# EAGLE board FastDataAcqSch (EAGLE 6.5.0), part 1 of 3
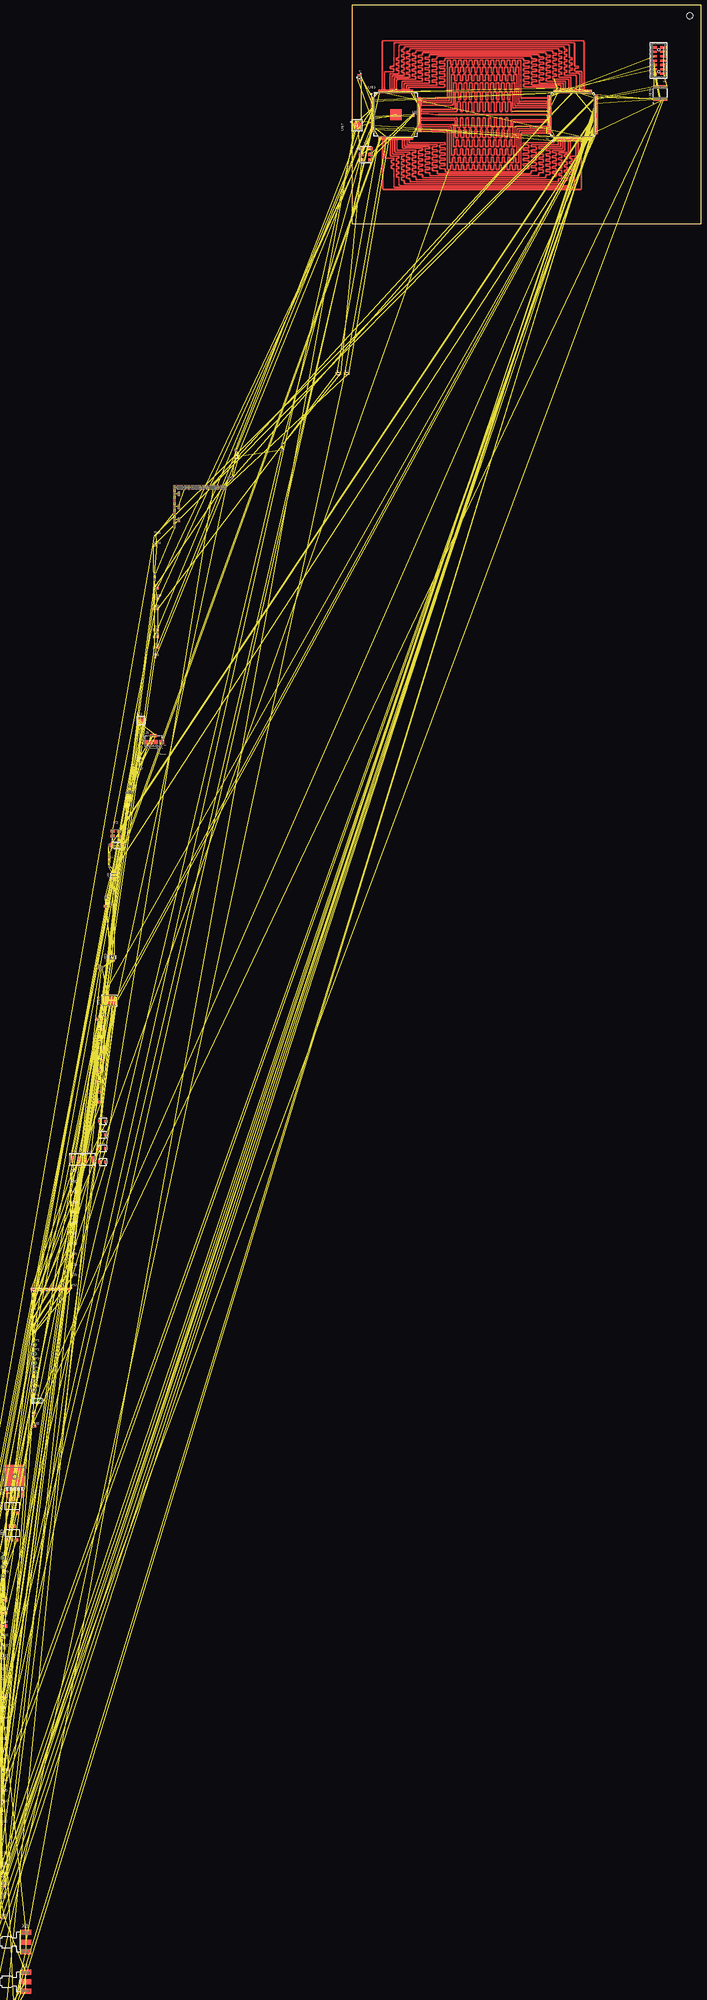
[diagram p3: board, top side]
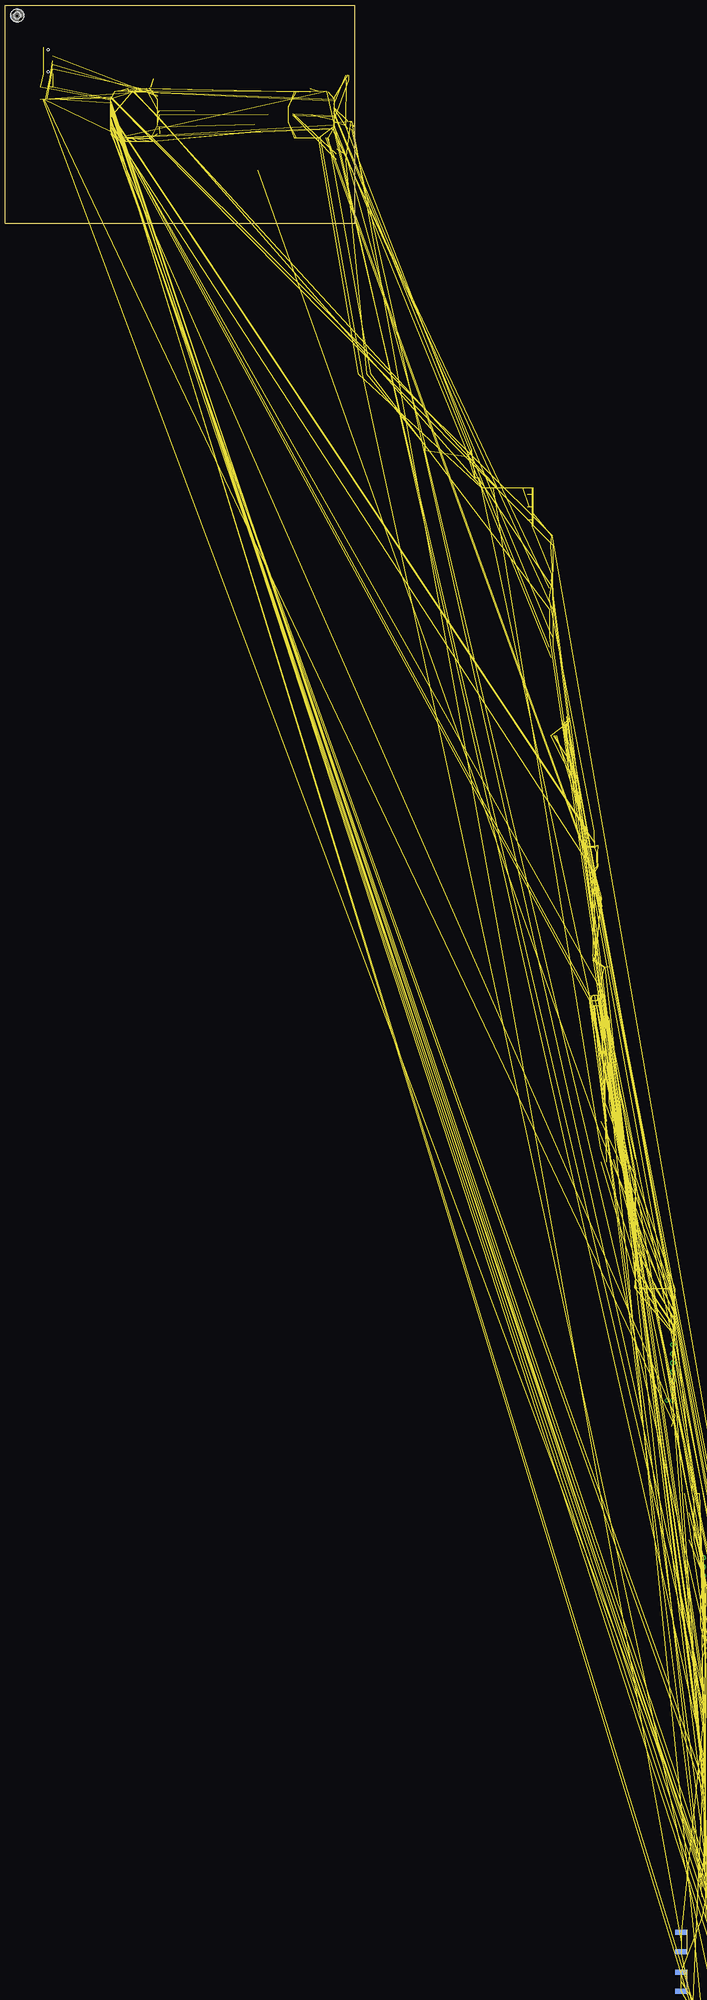
[diagram p4: board, bottom side, seen from below]

Size 160 x 100 mm. Coordinates in mm from the lower left corner, seen from the top.
Outline: 0,0 160,0 160,100 0,100 0,0
Copper layers ((1+2)*(3+16)): Top 0.035mm / dielectric 5mil / GND 0.035mm / dielectric 0.15mm / Power 0.035mm / dielectric 5mil / Bottom 0.035mm
Design rules "default *": minimum track width 10mil, minimum drill 24mil, track to track 8mil, track to pad 8mil, pad to pad 8mil, via to via 8mil, smd to smd 8mil, copper to edge 40mil, drill to drill 8mil, minimum pad ring 10mil, minimum via ring 8mil, stop-mask expansion 4mil, vias tented up to drill 0mil, thermal gap 10mil

## Footprints (pad centres in the part's own frame; a part is rotated, then mirrored left to right if it is on the bottom)
C0603 = smd 1.1 x 1: 1 -0.85,0; 2 0.85,0
2917_MURATA_CAP = smd 2.4 x 2.8: P$1 3.2,0; P$2 -3.2,0
C0201 = smd 0.25 x 0.35: 1 -0.25,0; 2 0.25,0
0805 = smd 0.8 x 1.2: 1 -0.9,0; 2 0.9,0
C0805 = smd 1.3 x 1.5: 1 -0.95,0; 2 0.95,0
0306REVERSE = smd 0.35 x 1.6: P$1 -0.325,0; P$2 0.325,0
0204REVERSE = smd 0.2 x 1: P$1 -0.2,0; P$2 0.2,0
0603_LED = smd 0.8 x 0.8: ANODE 0.75,0; CATHODE -0.75,0
2,8 = hole 2.8: 0,0
Q5-DD = smd 1 x 3.4: 1 -3.4,-7.875; 2 -1.7,-7.875; 3 0,-7.875; 4 1.7,-7.875; 5 3.4,-7.875 | smd 8.5 x 9.6: 6 0,0.325
QFN16 = smd 0.7 x 0.35: 1 -1.725,0.975; 2 -1.725,0.325; 3 -1.725,-0.325; 4 -1.725,-0.975; 9 1.725,-0.975; 10 1.725,-0.325; 11 1.725,0.325; 12 1.725,0.975 | smd 0.35 x 0.7: 5 -0.975,-1.725; 6 -0.325,-1.725; 7 0.325,-1.725; 8 0.975,-1.725; 13 0.975,1.725; 14 0.325,1.725; 15 -0.325,1.725; 16 -0.975,1.725 | smd 1 x 1: TAB 0,0
SOP65P490X110-8N = smd 1.499 x 0.432: 1 -2.057,0.965; 2 -2.057,0.33; 3 -2.057,-0.33; 4 -2.057,-0.965; 5 2.057,-0.965; 6 2.057,-0.33; 7 2.057,0.33; 8 2.057,0.965
USB_MICROAB_SMT_1 = smd 0.4 x 1.4: D+ 0,4.3; D- -0.65,4.3; GND 1.3,4.3; ID 0.65,4.3; VCC -1.3,4.3 | smd 2.3 x 1.9: P$1 3.75,1.45; P$5 -3.75,1.45 | smd 1.8 x 1.9: P$2 1.15,1.45; P$4 -1.15,1.45
MICRO-FIT_3.02POS_RA_SMD = smd 1.27 x 2.92: P$1 1.5,4.305; P$2 -1.5,4.305 | smd 3.43 x 1.65: P$3 5.385,-1.165; P$4 -5.385,-1.165
1X02 = drill 1.016 pad 1.88: 1 0,0; 2 2.54,0
1X10 = drill 1.016 pad 1.88: 1 0,0; 2 2.54,0; 3 5.08,0; 4 7.62,0; 5 10.16,0; 6 12.7,0; 7 15.24,0; 8 17.78,0; 9 20.32,0; 10 22.86,0
3.0X3.6_VISHAY = smd 1.5 x 1.2: P$1 -1.35,0; P$2 1.35,0
5.18X5.49_VISHAY = smd 1.915 x 2.79: P$1 -2.038,0; P$2 2.038,0
MURATA_BLM18 = smd 0.65 x 0.7: P$1 0.675,0; P$2 -0.675,0
ACM7060_CHOKE = smd 2.5 x 1.5: P$1 -3.25,1.5; P$2 -3.25,-1.5; P$3 3.25,-1.5; P$4 3.25,1.5
R0603 = smd 1 x 1.1: 1 -0.85,0; 2 0.85,0
R0201 = smd 0.28 x 0.43: 1 -0.255,0; 2 0.255,0
R0402 = smd 0.7 x 0.9: 1 -0.65,0; 2 0.65,0
P1-13 = drill 1.321 pad 2.159 octagon: TP 0,0
128HLQFP = smd 0.3 x 1.6: P$1 -7.75,-10.6; P$2 -7.25,-10.6; P$3 -6.75,-10.6; P$4 -6.25,-10.6; P$5 -5.75,-10.6; P$6 -5.25,-10.6; P$7 -4.75,-10.6; P$8 -4.25,-10.6; P$9 -3.75,-10.6; P$10 -3.25,-10.6; P$11 -2.75,-10.6; P$12 -2.25,-10.6; P$13 -1.75,-10.6; P$14 -1.25,-10.6; P$15 -0.75,-10.6; P$16 -0.25,-10.6; P$17 0.25,-10.6; P$18 0.75,-10.6; P$19 1.25,-10.6; P$20 1.75,-10.6; P$21 2.25,-10.6; P$22 2.75,-10.6; P$23 3.25,-10.6; P$24 3.75,-10.6; P$25 4.25,-10.6; P$26 4.75,-10.6; P$27 5.25,-10.6; P$28 5.75,-10.6; P$29 6.25,-10.6; P$30 6.75,-10.6; P$31 7.25,-10.6; P$32 7.75,-10.6; P$65 7.75,10.6; P$66 7.25,10.6; P$67 6.75,10.6; P$68 6.25,10.6; P$69 5.75,10.6; P$70 5.25,10.6; P$71 4.75,10.6; P$72 4.25,10.6; P$73 3.75,10.6; P$74 3.25,10.6; P$75 2.75,10.6; P$76 2.25,10.6; P$77 1.75,10.6; P$78 1.25,10.6; P$79 0.75,10.6; P$80 0.25,10.6; P$81 -0.25,10.6; P$82 -0.75,10.6; P$83 -1.25,10.6; P$84 -1.75,10.6; P$85 -2.25,10.6; P$86 -2.75,10.6; P$87 -3.25,10.6; P$88 -3.75,10.6; P$89 -4.25,10.6; P$90 -4.75,10.6; P$91 -5.25,10.6; P$92 -5.75,10.6; P$93 -6.25,10.6; P$94 -6.75,10.6; P$95 -7.25,10.6; P$96 -7.75,10.6 | smd 1.6 x 0.3: P$33 10.6,-7.75; P$34 10.6,-7.25; P$35 10.6,-6.75; P$36 10.6,-6.25; P$37 10.6,-5.75; P$38 10.6,-5.25; P$39 10.6,-4.75; P$40 10.6,-4.25; P$41 10.6,-3.75; P$42 10.6,-3.25; P$43 10.6,-2.75; P$44 10.6,-2.25; P$45 10.6,-1.75; P$46 10.6,-1.25; P$47 10.6,-0.75; P$48 10.6,-0.25; P$49 10.6,0.25; P$50 10.6,0.75; P$51 10.6,1.25; P$52 10.6,1.75; P$53 10.6,2.25; P$54 10.6,2.75; P$55 10.6,3.25; P$56 10.6,3.75; P$57 10.6,4.25; P$58 10.6,4.75; P$59 10.6,5.25; P$60 10.6,5.75; P$61 10.6,6.25; P$62 10.6,6.75; P$63 10.6,7.25; P$64 10.6,7.75; P$97 -10.6,7.75; P$98 -10.6,7.25; P$99 -10.6,6.75; P$100 -10.6,6.25; P$101 -10.6,5.75; P$102 -10.6,5.25; P$103 -10.6,4.75; P$104 -10.6,4.25; P$105 -10.6,3.75; P$106 -10.6,3.25; P$107 -10.6,2.75; P$108 -10.6,2.25; P$109 -10.6,1.75; P$110 -10.6,1.25; P$111 -10.6,0.75; P$112 -10.6,0.25; P$113 -10.6,-0.25; P$114 -10.6,-0.75; P$115 -10.6,-1.25; P$116 -10.6,-1.75; P$117 -10.6,-2.25; P$118 -10.6,-2.75; P$119 -10.6,-3.25; P$120 -10.6,-3.75; P$121 -10.6,-4.25; P$122 -10.6,-4.75; P$123 -10.6,-5.25; P$124 -10.6,-5.75; P$125 -10.6,-6.25; P$126 -10.6,-6.75; P$127 -10.6,-7.25; P$128 -10.6,-7.75 | smd 5 x 5: P$129 0,0
TQG144 = smd 0.3 x 1.6: P$1 -8.75,-10.7; P$2 -8.25,-10.7; P$3 -7.75,-10.7; P$4 -7.25,-10.7; P$5 -6.75,-10.7; P$6 -6.25,-10.7; P$7 -5.75,-10.7; P$8 -5.25,-10.7; P$9 -4.75,-10.7; P$10 -4.25,-10.7; P$11 -3.75,-10.7; P$12 -3.25,-10.7; P$13 -2.75,-10.7; P$14 -2.25,-10.7; P$15 -1.75,-10.7; P$16 -1.25,-10.7; P$17 -0.75,-10.7; P$18 -0.25,-10.7; P$19 0.25,-10.7; P$20 0.75,-10.7; P$21 1.25,-10.7; P$22 1.75,-10.7; P$23 2.25,-10.7; P$24 2.75,-10.7; P$25 3.25,-10.7; P$26 3.75,-10.7; P$27 4.25,-10.7; P$28 4.75,-10.7; P$29 5.25,-10.7; P$30 5.75,-10.7; P$31 6.25,-10.7; P$32 6.75,-10.7; P$33 7.25,-10.7; P$34 7.75,-10.7; P$35 8.25,-10.7; P$36 8.75,-10.7; P$73 8.75,10.7; P$74 8.25,10.7; P$75 7.75,10.7; P$76 7.25,10.7; P$77 6.75,10.7; P$78 6.25,10.7; P$79 5.75,10.7; P$80 5.25,10.7; P$81 4.75,10.7; P$82 4.25,10.7; P$83 3.75,10.7; P$84 3.25,10.7; P$85 2.75,10.7; P$86 2.25,10.7; P$87 1.75,10.7; P$88 1.25,10.7; P$89 0.75,10.7; P$90 0.25,10.7; P$91 -0.25,10.7; P$92 -0.75,10.7; P$93 -1.25,10.7; P$94 -1.75,10.7; P$95 -2.25,10.7; P$96 -2.75,10.7; P$97 -3.25,10.7; P$98 -3.75,10.7; P$99 -4.25,10.7; P$100 -4.75,10.7; P$101 -5.25,10.7; P$102 -5.75,10.7; P$103 -6.25,10.7; P$104 -6.75,10.7; P$105 -7.25,10.7; P$106 -7.75,10.7; P$107 -8.25,10.7; P$108 -8.75,10.7 | smd 1.6 x 0.3: P$37 10.7,-8.75; P$38 10.7,-8.25; P$39 10.7,-7.75; P$40 10.7,-7.25; P$41 10.7,-6.75; P$42 10.7,-6.25; P$43 10.7,-5.75; P$44 10.7,-5.25; P$45 10.7,-4.75; P$46 10.7,-4.25; P$47 10.7,-3.75; P$48 10.7,-3.25; P$49 10.7,-2.75; P$50 10.7,-2.25; P$51 10.7,-1.75; P$52 10.7,-1.25; P$53 10.7,-0.75; P$54 10.7,-0.25; P$55 10.7,0.25; P$56 10.7,0.75; P$57 10.7,1.25; P$58 10.7,1.75; P$59 10.7,2.25; P$60 10.7,2.75; P$61 10.7,3.25; P$62 10.7,3.75; P$63 10.7,4.25; P$64 10.7,4.75; P$65 10.7,5.25; P$66 10.7,5.75; P$67 10.7,6.25; P$68 10.7,6.75; P$69 10.7,7.25; P$70 10.7,7.75; P$71 10.7,8.25; P$72 10.7,8.75; P$109 -10.7,8.75; P$110 -10.7,8.25; P$111 -10.7,7.75; P$112 -10.7,7.25; P$113 -10.7,6.75; P$114 -10.7,6.25; P$115 -10.7,5.75; P$116 -10.7,5.25; P$117 -10.7,4.75; P$118 -10.7,4.25; P$119 -10.7,3.75; P$120 -10.7,3.25; P$121 -10.7,2.75; P$122 -10.7,2.25; P$123 -10.7,1.75; P$124 -10.7,1.25; P$125 -10.7,0.75; P$126 -10.7,0.25; P$127 -10.7,-0.25; P$128 -10.7,-0.75; P$129 -10.7,-1.25; P$130 -10.7,-1.75; P$131 -10.7,-2.25; P$132 -10.7,-2.75; P$133 -10.7,-3.25; P$134 -10.7,-3.75; P$135 -10.7,-4.25; P$136 -10.7,-4.75; P$137 -10.7,-5.25; P$138 -10.7,-5.75; P$139 -10.7,-6.25; P$140 -10.7,-6.75; P$141 -10.7,-7.25; P$142 -10.7,-7.75; P$143 -10.7,-8.25; P$144 -10.7,-8.75
38-QFN_(5X7) = smd 0.25 x 0.7: P$1 -2.75,-2.4; P$2 -2.25,-2.4; P$3 -1.75,-2.4; P$4 -1.25,-2.4; P$5 -0.75,-2.4; P$6 -0.25,-2.4; P$7 0.25,-2.4; P$8 0.75,-2.4; P$9 1.25,-2.4; P$10 1.75,-2.4; P$11 2.25,-2.4; P$12 2.75,-2.4; P$20 2.75,2.4; P$21 2.25,2.4; P$22 1.75,2.4; P$23 1.25,2.4; P$24 0.75,2.4; P$25 0.25,2.4; P$26 -0.25,2.4; P$27 -0.75,2.4; P$28 -1.25,2.4; P$29 -1.75,2.4; P$30 -2.25,2.4; P$31 -2.75,2.4 | smd 0.7 x 0.25: P$13 3.4,-1.5; P$14 3.4,-1; P$15 3.4,-0.5; P$16 3.4,0; P$17 3.4,0.5; P$18 3.4,1; P$19 3.4,1.5; P$32 -3.4,1.5; P$33 -3.4,1; P$34 -3.4,0.5; P$35 -3.4,0; P$36 -3.4,-0.5; P$37 -3.4,-1; P$38 -3.4,-1.5 | smd 5.15 x 3.15: P$39 0,0
SOT223 = smd 0.991 x 1.499: 1 -2.299,-3.15; 2 0,-3.15; 3 2.299,-3.15 | smd 3.277 x 1.499: 4 0,3.15
SOT23-8 = smd 0.45 x 1.1: P$1 -0.975,-1.3; P$2 -0.325,-1.3; P$3 0.325,-1.3; P$4 0.975,-1.3; P$5 0.975,1.3; P$6 0.325,1.3; P$7 -0.325,1.3; P$8 -0.975,1.3
16WQFN = smd 0.25 x 0.6: P$1 0.75,1.9; P$2 0.25,1.9; P$3 -0.25,1.9; P$4 -0.75,1.9; P$9 -0.75,-1.9; P$10 -0.25,-1.9; P$11 0.25,-1.9; P$12 0.75,-1.9 | smd 0.6 x 0.25: P$5 -1.9,0.75; P$6 -1.9,0.25; P$7 -1.9,-0.25; P$8 -1.9,-0.75; P$13 1.9,-0.75; P$14 1.9,-0.25; P$15 1.9,0.25; P$16 1.9,0.75 | smd 2.6 x 2.6: P$17 0,0
SC-70 = smd 0.4 x 0.9: P$1 -0.65,-1.1; P$2 0,-1.1; P$3 0.65,-1.1; P$4 0.65,1.1; P$5 -0.65,1.1
SOT23-6 = smd 0.6 x 1.1: P$1 -0.95,-1.35; P$2 0,-1.35; P$3 0.95,-1.35; P$4 0.95,1.35; P$5 0,1.35; P$6 -0.95,1.35
TSSOP20_XILINX = smd 1.5 x 0.45: P$1 -2.9,2.925; P$2 -2.9,2.275; P$3 -2.9,1.625; P$4 -2.9,0.975; P$5 -2.9,0.325; P$6 -2.9,-0.325; P$7 -2.9,-0.975; P$8 -2.9,-1.625; P$9 -2.9,-2.275; P$10 -2.9,-2.925; P$11 2.9,-2.925; P$12 2.9,-2.275; P$13 2.9,-1.625; P$14 2.9,-0.975; P$15 2.9,-0.325; P$16 2.9,0.325; P$17 2.9,0.975; P$18 2.9,1.625; P$19 2.9,2.275; P$20 2.9,2.925
C_AND_K_1101M2S3AQE2 = drill 1.854: P$1 4.699,4.763; P$2 0,4.763; P$3 -4.699,4.763; P$4 6.604,-4.763; P$5 -6.604,-4.763
J502-ND-142-0701-801/806 = smd 5.08 x 2.286: 1 2.565,0; G@1 2.565,4.42; G@2 2.565,-4.42 | smd 5.08 x 2.286 bottom: G@3 2.565,4.42; G@4 2.565,-4.42
87832-14 = smd 1 x 2.75: 1 -6,-2.15; 2 -6,2.15; 3 -4,-2.15; 4 -4,2.15; 5 -2,-2.15; 6 -2,2.15; 7 0,-2.15; 8 0,2.15; 9 2,-2.15; 10 2,2.15; 11 4,-2.15; 12 4,2.15; 13 6,-2.15; 14 6,2.15 | hole 1: -5,0; 5,0
SI530 = smd 1.95 x 1.55: P$1 -2.1,2.54; P$2 -2.1,0; P$3 -2.1,-2.54; P$4 2.1,-2.54; P$5 2.1,0; P$6 2.1,2.54
SI500S = smd 1.7 x 1.4: P$1 -1.45,-1.2; P$2 1.45,-1.2; P$3 1.45,1.2; P$4 -1.45,1.2
UMAX8 = smd 1.35 x 0.4: P$1 -2.15,0.975; P$2 -2.15,0.325; P$3 -2.15,-0.325; P$4 -2.15,-0.975; P$5 2.15,-0.975; P$6 2.15,-0.325; P$7 2.15,0.325; P$8 2.15,0.975

## Placement (x,y rotation side)
C1  10uF  [C0603]  -115.82,-373.84 0 top  (outside the outline)
C2  10uF  [C0603]  -115.82,-383.34 0 top  (outside the outline)
C3  100uF  [2917_MURATA_CAP]  -211.28,-896.24 0 top  (outside the outline)
C4  10uF  [C0603]  -115.82,-397.59 0 top  (outside the outline)
C5  NA  [C0603]  -160.15,-756.82 0 top  (outside the outline)
C6  10uF  [C0603]  -115.82,-388.09 0 top  (outside the outline)
C7  10uF  [C0603]  -115.82,-402.34 0 top  (outside the outline)
C8  10pF  [C0201]  -146.38,-508.61 0 top  (outside the outline)
C9  10pF  [C0201]  -146.38,-494.89 0 top  (outside the outline)
C10  33uF  [0805]  -131.27,-487.91 0 top  (outside the outline)
C11  33uF  [0805]  -143.05,-487.91 0 top  (outside the outline)
C12  10uF  [C0603]  -115.82,-378.59 0 top  (outside the outline)
C13  10uF  [C0603]  -115.82,-364.34 0 top  (outside the outline)
C14  10pF  [C0201]  -146.38,-501.75 0 top  (outside the outline)
C15  10uF  [C0603]  -115.82,-369.09 0 top  (outside the outline)
C17  10uF  [C0603]  -115.82,-392.84 0 top  (outside the outline)
C18  NA  [C0603]  -160.15,-775.82 0 top  (outside the outline)
C19  33uF  [0805]  -137.16,-487.91 0 top  (outside the outline)
C20  10uF  [C0603]  -160.15,-661.82 0 top  (outside the outline)
C21  10uF  [C0603]  -160.15,-666.57 0 top  (outside the outline)
C22  10uF  [C0603]  -160.15,-657.07 0 top  (outside the outline)
C23  22uF 150mOhm ESR  [C0805]  -159.64,-636.17 0 top  (outside the outline)
C24  22uF 150mOhm ESR  [C0805]  -159.64,-642.19 0 top  (outside the outline)
C25  10pF  [C0201]  -146.38,-505.18 0 top  (outside the outline)
C26  10pF  [C0201]  -146.38,-498.32 0 top  (outside the outline)
C27  10pF  [C0201]  -146.38,-491.46 0 top  (outside the outline)
C28  33uF  [0805]  -134.21,-487.91 0 top  (outside the outline)
C29  33uF  [0805]  -140.11,-487.91 0 top  (outside the outline)
C30  33uF  [0805]  -146,-487.91 0 top  (outside the outline)
C31  22uF 150mOhm ESR  [C0805]  -159.64,-630.15 0 top  (outside the outline)
C32  4.7uF  [0306REVERSE]  -59.97,-120.78 0 top  (outside the outline)
C33  4.7uF  [0306REVERSE]  -78.13,-120.78 0 top  (outside the outline)
C34  4.7uF  [0306REVERSE]  -81.43,-129.62 0 top  (outside the outline)
C35  4.7uF  [0306REVERSE]  -61.62,-120.78 0 top  (outside the outline)
C36  0.47uF  [0306REVERSE]  -79.78,-120.78 0 top  (outside the outline)
C37  0.47uF  [0306REVERSE]  -79.4,-129.62 0 top  (outside the outline)
C38  33uF  [0805]  -6.35,-68.58 0 top  (outside the outline)
C39  33uF  [0805]  -2.54,-68.58 0 top  (outside the outline)
C40  4.7uF  [0306REVERSE]  -63.27,-120.78 0 top  (outside the outline)
C41  0.47uF  [0306REVERSE]  -81.43,-120.78 0 top  (outside the outline)
C42  0.47uF  [0306REVERSE]  -81.43,-132.56 0 top  (outside the outline)
C43  .1uF  [0204REVERSE]  -179.63,-865.3 0 top  (outside the outline)
C44  .1uF  [0204REVERSE]  -177.6,-865.3 0 top  (outside the outline)
C45  0.47uF  [0306REVERSE]  -58.32,-120.78 0 top  (outside the outline)
C46  .1uF  [0204REVERSE]  -175.56,-865.3 0 top  (outside the outline)
C47  .1uF  [0204REVERSE]  -179.63,-867.89 0 top  (outside the outline)
C48  .1uF  [0204REVERSE]  -177.6,-867.89 0 top  (outside the outline)
C49  .1uF  [0204REVERSE]  -175.56,-867.89 0 top  (outside the outline)
C50  4.7uF  [0306REVERSE]  -81.43,-123.72 0 top  (outside the outline)
C51  4.7uF  [0306REVERSE]  -81.43,-135.51 0 top  (outside the outline)
C52  4.7uF  [0306REVERSE]  -64.92,-120.78 0 top  (outside the outline)
C53  .1uF  [0204REVERSE]  -179.63,-870.48 0 top  (outside the outline)
C54  .1uF  [0204REVERSE]  -177.6,-870.48 0 top  (outside the outline)
C55  0.47uF  [0306REVERSE]  -79.4,-123.72 0 top  (outside the outline)
C56  0.47uF  [0306REVERSE]  -79.4,-135.51 0 top  (outside the outline)
C57  4.7uF  [0306REVERSE]  -66.57,-120.78 0 top  (outside the outline)
C58  .1uF  [0204REVERSE]  -175.56,-870.48 0 top  (outside the outline)
C59  10nF  [C0201]  -221.26,-901.95 0 top  (outside the outline)
C60  4.7uF  [0306REVERSE]  -68.22,-120.78 0 top  (outside the outline)
C61  0.47uF  [0306REVERSE]  -81.43,-126.67 0 top  (outside the outline)
C62  0.47uF  [0306REVERSE]  -81.43,-138.46 0 top  (outside the outline)
C63  1uF  [0204REVERSE]  -223.06,-902.16 0 top  (outside the outline)
C64  10nF  [C0201]  -225.15,-905.38 0 top  (outside the outline)
C65  4.7uF  [0306REVERSE]  -69.88,-120.78 0 top  (outside the outline)
C68  4.7uF  [0306REVERSE]  -71.53,-120.78 0 top  (outside the outline)
C71  4.7uF  [0306REVERSE]  -73.18,-120.78 0 top  (outside the outline)
C74  4.7uF  [0306REVERSE]  -74.83,-120.78 0 top  (outside the outline)
C76  0.47uF  [0306REVERSE]  -76.48,-120.78 0 top  (outside the outline)
C77  100pF  [C0603]  -112.52,-312.6 0 top  (outside the outline)
C78  .1uF  [0204REVERSE]  -56.67,-116.36 0 top  (outside the outline)
C79  .1uF  [0204REVERSE]  -55.02,-116.36 0 top  (outside the outline)
C80  4.7nF  [C0201]  28.14,50.19 0 top
C81  4.7nF  [C0201]  28.14,49.4 0 top
C82  .1uF  [0204REVERSE]  -53.37,-103.68 0 top  (outside the outline)
C83  .1uF  [0204REVERSE]  -113.03,-308.69 0 top  (outside the outline)
C84  33uF  [0805]  -52.86,-106.63 0 top  (outside the outline)
C85  .1uF  [0204REVERSE]  -32.08,-101.09 0 top  (outside the outline)
C86  1uF  [0204REVERSE]  -32.08,-103.68 0 top  (outside the outline)
C87  33uF  [0805]  -160.12,-625.27 0 top  (outside the outline)
C88  4.7uF  [0306REVERSE]  -116.33,-340.36 0 top  (outside the outline)
C89  .1uF  [0204REVERSE]  -114.68,-340.69 0 top  (outside the outline)
C90  10nF  [C0201]  -160.5,-622.12 0 top  (outside the outline)
C91  .1uF  [0204REVERSE]  -111.38,-284.66 0 top  (outside the outline)
C92  10nF  [C0201]  -111.25,-287.91 0 top  (outside the outline)
C93  .1uF  [0204REVERSE]  -111.38,-294.13 0 top  (outside the outline)
C94  10nF  [C0201]  -111.25,-291.34 0 top  (outside the outline)
C95  10nF  [C0201]  -103.25,-270.81 0 top  (outside the outline)
C96  47pF  [C0201]  -103.25,-263.96 0 top  (outside the outline)
C97  .1uF  [0204REVERSE]  -90.45,-160.38 0 top  (outside the outline)
C98  47pF  [C0201]  -103.25,-267.39 0 top  (outside the outline)
C99  1uF  [0204REVERSE]  -90.45,-162.97 0 top  (outside the outline)
C100  .1uF  [0204REVERSE]  -103.38,-260.71 0 top  (outside the outline)
C101  .1uF  [0204REVERSE]  -101.73,-257.78 0 top  (outside the outline)
C102  4.7uF  [0306REVERSE]  -101.73,-260.38 0 top  (outside the outline)
C103  .1uF  [0204REVERSE]  -164.74,-862.71 0 top  (outside the outline)
C104  .1uF  [0204REVERSE]  -166.42,-862.71 0 top  (outside the outline)
C105  .1uF  [0204REVERSE]  -168.07,-862.71 0 top  (outside the outline)
C106  .1uF  [0204REVERSE]  -169.72,-862.71 0 top  (outside the outline)
C107  .1uF  [0204REVERSE]  -171.37,-862.71 0 top  (outside the outline)
C108  .1uF  [0204REVERSE]  -173.02,-862.71 0 top  (outside the outline)
C109  .1uF  [0204REVERSE]  -174.68,-862.71 0 top  (outside the outline)
C110  .1uF  [0204REVERSE]  -176.33,-862.71 0 top  (outside the outline)
C111  .1uF  [0204REVERSE]  -177.98,-862.71 0 top  (outside the outline)
C112  .1uF  [0204REVERSE]  -179.63,-862.71 0 top  (outside the outline)
D1  [0603_LED]  -229.77,-979.58 0 top  (outside the outline)
D2  [0603_LED]  -232.28,-984.33 0 top  (outside the outline)
D3  [0603_LED]  -234.8,-984.33 0 top  (outside the outline)
D4  [0603_LED]  -237.31,-993.83 0 top  (outside the outline)
D5  [0603_LED]  -239.83,-993.83 0 top  (outside the outline)
D6  [0603_LED]  -242.34,-993.83 0 top  (outside the outline)
H1  MOUNT-HOLE2.8  [2,8]  154.61,95.33 0 bottom
H2  MOUNT-HOLE2.8  [2,8]  -224.94,-943.99 0 top  (outside the outline)
H3  MOUNT-HOLE2.8  [2,8]  -224.94,-951.1 0 top  (outside the outline)
H4  MOUNT-HOLE2.8  [2,8]  -224.94,-958.22 0 top  (outside the outline)
IC1  LT1963AEQ  [Q5-DD]  -154.64,-573.63 0 top  (outside the outline)
IC2  FT230XQ  [QFN16]  -96.77,-227.51 0 top  (outside the outline)
IC3  ADCMP553BRMZ  [SOP65P490X110-8N]  -157,-819.45 0 top  (outside the outline)
J1  USB_MICROAB_SMT  [USB_MICROAB_SMT_1]  -91.16,-238.79 0 top  (outside the outline)
J2  MICRO-FIT_3.0_2POS_RA_SMD  [MICRO-FIT_3.02POS_RA_SMD]  -204.04,-880.77 0 top  (outside the outline)
JP1  [1X02]  -145.67,-538.91 0 top  (outside the outline)
JP2  M10"  [1X10]  -241.73,-998.88 0 top  (outside the outline)
JP3  [1X02]  -226.64,-972.52 0 top  (outside the outline)
L1  2.2uH  [3.0X3.6_VISHAY]  -114.2,-429.67 0 top  (outside the outline)
L2  2.2uH  [3.0X3.6_VISHAY]  -114.2,-411.07 0 top  (outside the outline)
L3  2.2uH  [5.18X5.49_VISHAY]  -120.5,-428.45 0 top  (outside the outline)
L4  2.2uH  [3.0X3.6_VISHAY]  -114.2,-423.47 0 top  (outside the outline)
L5  2.2uH  [3.0X3.6_VISHAY]  -114.2,-417.27 0 top  (outside the outline)
L6  2.2uH  [5.18X5.49_VISHAY]  -126.75,-428.45 0 top  (outside the outline)
L7  [MURATA_BLM18]  -216.89,-899.01 0 top  (outside the outline)
L8  [MURATA_BLM18]  -219.1,-899.01 0 top  (outside the outline)
L9  [MURATA_BLM18]  -225.2,-902.46 0 top  (outside the outline)
L10  [MURATA_BLM18]  -221.31,-899.01 0 top  (outside the outline)
L11  [MURATA_BLM18]  -227.41,-910.64 0 top  (outside the outline)
L12  CHOKE_CM_ACM7060-301  [ACM7060_CHOKE]  -201.45,-866.98 0 top  (outside the outline)
L13  [MURATA_BLM18]  -214.68,-890.88 0 top  (outside the outline)
R1  NA  [R0603]  -89.97,-189.23 0 top  (outside the outline)
R2  NA  [R0603]  -89.97,-185.88 0 top  (outside the outline)
R3  NA  [R0603]  -89.97,-193.98 0 top  (outside the outline)
R4  10k  [R0201]  -90.32,-198.73 0 top  (outside the outline)
R5  10k  [R0201]  -160.5,-680.82 0 top  (outside the outline)
R6  NA  [R0603]  -89.97,-176.38 0 top  (outside the outline)
R7  3.3k 0.1%  [R0603]  -89.97,-166.88 0 top  (outside the outline)
R8  10k  [R0201]  -160.5,-704.57 0 top  (outside the outline)
R9  4.7k  [R0201]  -146.38,-545.97 0 top  (outside the outline)
R10  NA  [R0603]  -160.15,-761.57 0 top  (outside the outline)
R11  649K  [R0201]  -160.5,-752.07 0 top  (outside the outline)
R12  150K  [R0201]  -160.5,-747.32 0 top  (outside the outline)
R13  NA  [R0603]  -160.15,-766.32 0 top  (outside the outline)
R14  523K  [R0201]  -160.5,-723.57 0 top  (outside the outline)
R15  523K  [R0201]  -128.68,-482.65 0 top  (outside the outline)
R16  523K  [R0201]  -128.68,-444.65 0 top  (outside the outline)
R17  210K  [R0201]  -128.68,-487.4 0 top  (outside the outline)
R18  150K  [R0201]  -128.68,-449.4 0 top  (outside the outline)
R19  523K  [R0201]  -128.68,-463.65 0 top  (outside the outline)
R20  280K  [R0201]  -128.68,-468.4 0 top  (outside the outline)
R21  270k  [R0201]  -160.5,-728.32 0 top  (outside the outline)
R22  210K  [R0201]  -160.5,-733.07 0 top  (outside the outline)
R23  10k  [R0201]  -227.36,-918.41 0 top  (outside the outline)
R24  1k  [R0201]  -229.87,-983.44 0 top  (outside the outline)
R25  210K  [R0201]  -128.68,-473.15 0 top  (outside the outline)
R26  806K  [R0201]  -128.68,-454.15 0 top  (outside the outline)
R27  845k  [R0201]  -128.68,-435.15 0 top  (outside the outline)
R28  649K  [R0201]  -128.68,-458.9 0 top  (outside the outline)
R29  422K  [R0201]  -128.68,-477.9 0 top  (outside the outline)
R30  270k  [R0201]  -128.68,-439.9 0 top  (outside the outline)
R31  1.15k 1%  [R0603]  -160.15,-647.57 0 top  (outside the outline)
R32  2k 1%  [R0603]  -160.15,-652.32 0 top  (outside the outline)
R33  50  [R0201]  -160.5,-676.07 0 top  (outside the outline)
R34  10k  [R0201]  -160.5,-685.57 0 top  (outside the outline)
R35  10k  [R0201]  -160.5,-690.32 0 top  (outside the outline)
R36  10k  [R0201]  -160.5,-695.07 0 top  (outside the outline)
R37  10k  [R0201]  -160.5,-699.82 0 top  (outside the outline)
R38  NA  [R0603]  -89.97,-171.63 0 top  (outside the outline)
R39  100 0.1%  [R0402]  -90.32,-147.45 0 top  (outside the outline)
R40  100 0.1%  [R0402]  -160.15,-709.32 0 top  (outside the outline)
R41  330  [R0201]  -90.32,-142.7 0 top  (outside the outline)
R42  4.7k  [R0201]  -225.15,-909.5 0 top  (outside the outline)
R43  0  [R0603]  -146.02,-550.72 0 top  (outside the outline)
R44  330  [R0201]  -160.5,-714.07 0 top  (outside the outline)
R45  330  [R0201]  -160.5,-718.82 0 top  (outside the outline)
R46  27  [R0201]  -98.27,-246.18 0 top  (outside the outline)
R47  27  [R0201]  -98.27,-250.93 0 top  (outside the outline)
R48  10k  [R0603]  -164.26,-826.03 0 top  (outside the outline)
R49  26.1k  [R0603]  -164.26,-830.78 0 top  (outside the outline)
R50  10k  [R0603]  -164.26,-835.53 0 top  (outside the outline)
R51  16k  [R0603]  -164.26,-840.28 0 top  (outside the outline)
R52  50  [R0201]  -164.62,-845.03 0 top  (outside the outline)
R53  50  [R0201]  -164.62,-849.78 0 top  (outside the outline)
R54  50  [R0201]  -164.62,-854.53 0 top  (outside the outline)
R55  100  [R0603]  -164.26,-859.28 0 top  (outside the outline)
R56  330  [R0201]  -234.9,-988.19 0 top  (outside the outline)
R57  330  [R0201]  -234.9,-992.94 0 top  (outside the outline)
R58  330  [R0201]  -242.44,-1004.9 0 top  (outside the outline)
R59  330  [R0201]  -242.44,-1009.65 0 top  (outside the outline)
R60  330  [R0201]  -242.44,-1014.4 0 top  (outside the outline)
R61  50  [R0201]  -242.44,-1027.48 0 top  (outside the outline)
R62  NA  [R0603]  -242.09,-1032.23 0 top  (outside the outline)
TP1  TPPAD1-13  [P1-13]  -145.75,-513.36 0 top  (outside the outline)
TP2  TPPAD1-13  [P1-13]  -145.75,-517.52 0 top  (outside the outline)
TP3  TPPAD1-13  [P1-13]  -145.75,-521.69 0 top  (outside the outline)
TP4  TPPAD1-13  [P1-13]  -145.75,-525.86 0 top  (outside the outline)
TP5  TPPAD1-13  [P1-13]  -145.75,-530.02 0 top  (outside the outline)
TP6  TPPAD1-13  [P1-13]  -145.75,-534.19 0 top  (outside the outline)
TP7  TPPAD1-13  [P1-13]  -159.87,-610.95 0 top  (outside the outline)
TP8  TPPAD1-13  [P1-13]  -159.87,-615.11 0 top  (outside the outline)
TP9  TPPAD1-13  [P1-13]  -159.87,-619.28 0 top  (outside the outline)
TP10  TPPAD1-13  [P1-13]  -226.72,-914.88 0 top  (outside the outline)
TP11  TPPAD1-13  [P1-13]  -226.72,-923.8 0 top  (outside the outline)
TP12  TPPAD1-13  [P1-13]  -226.97,-927.96 0 top  (outside the outline)
TP13  TPPAD1-13  [P1-13]  -226.72,-932.13 0 top  (outside the outline)
TP14  TPPAD1-13  [P1-13]  -241.81,-1019.78 0 top  (outside the outline)
TP15  TPPAD1-13  [P1-13]  -241.81,-1023.95 0 top  (outside the outline)
U$1  ADC08D500  [128HLQFP]  20,50 270 top
U$2  XC6SLX9-3TQG144C  [TQG144]  101,50 0 top
U$3  LTC3374QFN  [38-QFN_(5X7)]  -111.28,-355.73 0 top  (outside the outline)
U$4  LT1963AEST-2.5  [SOT223]  -155.73,-587.32 0 top  (outside the outline)
U$5  LT1963AEST-3.3  [SOT223]  -155.73,-599.64 0 top  (outside the outline)
U$6  TMP421  [SOT23-8]  -109.19,-298.25 0 top  (outside the outline)
U$7  LMH6555  [16WQFN]  2.21,45.14 90 top
U$8  LMV321SC-70  [SC-70]  3.3,67.06 180 top
U$9  DAC101C081  [SOT23-6]  -109.98,-336.02 0 top  (outside the outline)
U$10  XCFXXS04  [TSSOP20_XILINX]  141.17,59.92 90 top
U$11  SLIDER_SPDT_1101M2S3AQE2  [C_AND_K_1101M2S3AQE2]  -188.75,-861.82 0 top  (outside the outline)
X1  SMA-142-0701-801/806  [J502-ND-142-0701-801/806]  -152.12,-805.18 0 top  (outside the outline)
X2  87832-14  [87832-14]  140.44,74.75 90 top
X3  SMA-142-0701-801/806  [J502-ND-142-0701-801/806]  -152.12,-786.97 0 top  (outside the outline)
Y1  SI530-500  [SI530]  6.27,31.83 0 top
Y2  DNP  [SI500S]  -108.33,-279.27 0 top  (outside the outline)
Y3  100MHz  [UMAX8]  -107.8,-284.63 0 top  (outside the outline)

## Tracks (layer width: path | path; a pad name or v marks a point on that pad's centre or on a via)
1V2  (12 unrouted)
1V8  (15 unrouted)
  Top 0.152: U$2.P$122 89.28,51.75 89.17,51.64 73.3,51.64 | U$2.P$125 89.28,49.75 89.17,49.86 39.6,49.86 | U$2.P$135 89.28,44.25 89.17,44.36 75.08,44.36 arc90 74.62,43.9 74.62,35.8 arc-90 73.88,35.07 73.86,35.07 arc-90 73.12,35.8 73.12,37.87 arc90 72.66,38.32 72.64,38.32 arc90 72.18,37.87 72.18,35.8 arc-90 71.44,35.07 71.42,35.07 arc-90 70.68,35.8 70.68,37.87 arc90 70.22,38.32 70.2,38.32 arc90 69.74,37.87 69.74,35.8 arc-90 69,35.07 68.98,35.07 arc-90 68.24,35.8 68.24,37.87 arc90 67.78,38.32 67.76,38.32 arc90 67.3,37.87 67.3,35.8 arc-90 66.56,35.07 66.54,35.07 arc-90 65.8,35.8 65.8,37.87 arc90 65.34,38.32 65.32,38.32 arc90 64.86,37.87 64.86,35.8 arc-90 64.12,35.07 64.1,35.07 arc-90 63.36,35.8 63.36,37.87 arc90 62.9,38.32 62.88,38.32 arc90 62.42,37.87 62.42,35.8 arc-90 61.68,35.07 61.66,35.07 arc-90 60.92,35.8 60.92,37.87 arc90 60.46,38.32 60.44,38.32 arc90 59.98,37.87 59.98,35.8 arc-90 59.24,35.07 59.22,35.07 arc-90 58.48,35.8 58.48,37.87 arc90 58.02,38.32 58,38.32 arc90 57.54,37.87 57.54,35.8 arc-90 56.8,35.07 56.78,35.07 arc-90 56.04,35.8 56.04,37.87 arc90 55.58,38.32 55.56,38.32 arc90 55.1,37.87 55.1,35.8 arc-90 54.36,35.07 54.34,35.07 arc-90 53.6,35.8 53.6,37.87 arc90 53.14,38.32 53.12,38.32 arc90 52.66,37.87 52.66,35.8 arc-90 51.92,35.07 51.9,35.07 arc-90 51.16,35.8 51.16,37.87 arc90 50.7,38.32 50.68,38.32 arc90 50.22,37.87 50.22,35.8 arc-90 49.48,35.07 49.46,35.07 arc-90 48.72,35.8 48.72,37.87 arc90 48.26,38.32 48.24,38.32 arc90 47.78,37.87 47.78,35.8 arc-90 47.04,35.07 47.02,35.07 arc-90 46.28,35.8 46.28,44.9 arc90 45.82,45.36
  Top 0.152: U$2.P$144 89.28,41.25 89.17,41.36 77.74,41.36 arc90 77.29,40.9 77.29,25.3 arc-90 76.55,24.56 76.51,24.56 arc-90 75.77,25.3 75.77,26.36 arc90 75.31,26.82 75.27,26.82 arc90 74.81,26.36 74.81,25.3 arc-90 74.08,24.56 74.03,24.56 arc-90 73.3,25.3 73.3,26.36 arc90 72.84,26.82 72.8,26.82 arc90 72.34,26.36 72.34,25.3 arc-90 71.6,24.56 71.56,24.56 arc-90 70.82,25.3 70.82,26.36 arc90 70.36,26.82 70.32,26.82 arc90 69.86,26.36 69.86,25.3 arc-90 69.13,24.56 69.09,24.56 arc-90 68.35,25.3 68.35,26.36 arc90 67.89,26.82 67.85,26.82 arc90 67.39,26.36 67.39,25.3 arc-90 66.66,24.56 66.61,24.56 arc-90 65.88,25.3 65.88,26.36 arc90 65.42,26.82 65.38,26.82 arc90 64.92,26.36 64.92,25.3 arc-90 64.18,24.56 64.14,24.56 arc-90 63.4,25.3 63.4,26.36 arc90 62.95,26.82 62.9,26.82 arc90 62.45,26.36 62.45,25.3 arc-90 61.71,24.56 61.66,24.56 arc-90 60.93,25.3 60.93,26.36 arc90 60.47,26.82 60.43,26.82 arc90 59.97,26.36 59.97,25.3 arc-90 59.23,24.56 59.19,24.56 arc-90 58.45,25.3 58.45,26.36 arc90 58,26.82 57.95,26.82 arc90 57.5,26.36 57.5,25.3 arc-90 56.76,24.56 56.72,24.56 arc-90 55.98,25.3 55.98,26.36 arc90 55.52,26.82 55.48,26.82 arc90 55.02,26.36 55.02,25.3 arc-90 54.29,24.56 54.24,24.56 arc-90 53.51,25.3 53.51,26.36 arc90 53.05,26.82 53.01,26.82 arc90 52.55,26.36 52.55,25.3 arc-90 51.81,24.56 51.77,24.56 arc-90 51.03,25.3 51.03,26.36 arc90 50.58,26.82 50.53,26.82 arc90 50.08,26.36 50.08,25.3 arc-90 49.34,24.56 49.3,24.56 arc-90 48.56,25.3 48.56,26.36 arc90 48.1,26.82 48.06,26.82 arc90 47.6,26.36 47.6,25.3 arc-90 46.87,24.56 46.82,24.56 arc-90 46.09,25.3 46.09,26.36 arc90 45.63,26.82 45.59,26.82 arc90 45.13,26.36 45.13,25.3 arc-90 44.39,24.56 44.35,24.56 arc-90 43.61,25.3 43.61,41.9 arc90 43.16,42.36
  Top 0.152: U$2.P$103 95.25,61.72 95.47,61.94 95.47,62.19 | U$2.P$86 103.75,61.72 103.97,61.94 103.97,62.19 | U$2.P$4 94.25,38.28 94.47,38.06 94.47,37.81 | U$2.P$18 102.25,38.28 102.47,38.06 102.47,37.81
1V9  (6 unrouted)
1V9A  (27 unrouted)
1V9D  (18 unrouted)
  Top 0.152: U$1.P$99 25.75,61.62 25.75,62.09 arc-90 26.49,62.83 41.98,62.83 arc90 42.44,63.28 arc90 41.98,63.74 40.61,63.74 arc-90 39.87,64.48 arc-90 40.61,65.22 41.98,65.22 arc90 42.44,65.67 arc90 41.98,66.13 40.61,66.13 arc-90 39.87,66.87 arc-90 40.61,67.6 41.98,67.6 arc90 42.44,68.06 arc90 41.98,68.52 40.61,68.52 arc-90 39.87,69.25 arc-90 40.61,69.99 41.98,69.99 arc90 42.44,70.45 arc90 41.98,70.9 40.61,70.9 arc-90 39.87,71.64 arc-90 40.61,72.38 41.98,72.38 arc90 42.44,72.83 arc90 41.98,73.29 40.61,73.29 arc-90 39.87,74.03 arc-90 40.61,74.77 41.98,74.77 arc90 42.44,75.22 42.44,75.31 arc-90 43.18,76.04 77.82,76.04 arc-90 78.56,75.31 78.56,75.32 arc90 79.02,74.86 80.39,74.86 arc-90 81.13,74.13 arc-90 80.39,73.39 79.02,73.39 arc90 78.56,72.94 arc90 79.02,72.48 80.39,72.48 arc-90 81.13,71.74 arc-90 80.39,71 79.02,71 arc90 78.56,70.55 arc90 79.02,70.09 80.39,70.09 arc-90 81.13,69.35 arc-90 80.39,68.62 79.02,68.62 arc90 78.56,68.16 arc90 79.02,67.7 80.39,67.7 arc-90 81.13,66.97 arc-90 80.39,66.23 79.02,66.23 arc90 78.56,65.77 arc90 79.02,65.31 80.39,65.31 arc-90 81.13,64.58 arc-90 80.39,63.84 79.02,63.84 arc90 78.56,63.38 arc90 79.02,62.93 93.51,62.93 arc-90 94.25,62.19 | U$1.P$110 20.25,61.62 20.25,65.65 arc-90 20.99,66.38 28.65,66.38 arc90 29.11,66.84 arc90 28.65,67.3 28.15,67.3 arc-90 27.42,68.03 arc-90 28.15,68.77 28.65,68.77 arc90 29.11,69.23 arc90 28.65,69.69 28.15,69.69 arc-90 27.42,70.42 arc-90 28.15,71.16 28.65,71.16 arc90 29.11,71.62 arc90 28.65,72.07 28.15,72.07 arc-90 27.42,72.81 arc-90 28.15,73.55 28.65,73.55 arc90 29.11,74 arc90 28.65,74.46 28.15,74.46 arc-90 27.42,75.2 arc-90 28.15,75.93 28.65,75.93 arc90 29.11,76.39 arc90 28.65,76.85 28.15,76.85 arc-90 27.42,77.58 arc-90 28.15,78.32 28.65,78.32 arc90 29.11,78.78 29.11,78.86 arc-90 29.84,79.6 91.16,79.6 arc-90 91.89,78.86 91.89,78.88 arc90 92.35,78.42 92.85,78.42 arc-90 93.58,77.69 arc-90 92.85,76.95 92.35,76.95 arc90 91.89,76.49 arc90 92.35,76.03 92.85,76.03 arc-90 93.58,75.3 arc-90 92.85,74.56 92.35,74.56 arc90 91.89,74.1 arc90 92.35,73.65 92.85,73.65 arc-90 93.58,72.91 arc-90 92.85,72.17 92.35,72.17 arc90 91.89,71.72 arc90 92.35,71.26 92.85,71.26 arc-90 93.58,70.52 arc-90 92.85,69.78 92.35,69.78 arc90 91.89,69.33 arc90 92.35,68.87 92.85,68.87 arc-90 93.58,68.13 arc-90 92.85,67.4 92.35,67.4 arc90 91.89,66.94 arc90 92.35,66.48 98.51,66.48 arc-90 99.25,65.75 99.25,62.19
1V9F  (8 unrouted)
2V3_1V9PRE  (7 unrouted)
2V5  (3 unrouted)
2V5A  (5 unrouted)
2V8_2V5PRE  (7 unrouted)
3V3  (58 unrouted)
3V3A  (3 unrouted)
3V3S  (9 unrouted)
3V6_PRE3V3  (6 unrouted)
5VUSB  (3 unrouted)
5VUSB_CON  (2 unrouted)
!RXLED  (1 unrouted)
!TXLED  (1 unrouted)
ADC_CAL  (2 unrouted)
ADC_CALDLY/DES/!SCS  (2 unrouted)
ADC_CALRUN  (1 unrouted)
ADC_CLK+  (1 unrouted)
ADC_CLK-  (1 unrouted)
ADC_DCLK+
  Top 0.152: U$1.P$82 31.62,50.75 31.73,50.64 34.52,50.64 arc-11 37.06,50.39 arc11 39.6,50.14 89.17,50.14 89.28,50.25 U$2.P$126
ADC_DCLK-  (1 unrouted)
  Top 0.152: U$1.P$81 31.62,50.25 31.73,50.36 34.52,50.36 arc-11 37.06,50.11 arc11 39.6,49.86
ADC_DCLKRST  (1 unrouted)
ADC_FSR/ECE  (2 unrouted)
ADC_OUTEDGE/DDR/SDATA  (1 unrouted)
ADC_OUTV/SCLK  (1 unrouted)
ADC_PD  (2 unrouted)
ADC_PDQ  (1 unrouted)
  Top 0.152: U$2.P$143 89.28,41.75 89.17,41.64 77.74,41.64 arc90 77.01,40.9 77.01,25.3 arc-90 76.55,24.84 76.51,24.84 arc-90 76.05,25.3 76.05,26.36 arc90 75.31,27.1 75.27,27.1 arc90 74.53,26.36 74.53,25.3 arc-90 74.08,24.84 74.03,24.84 arc-90 73.58,25.3 73.58,26.36 arc90 72.84,27.1 72.8,27.1 arc90 72.06,26.36 72.06,25.3 arc-90 71.6,24.84 71.56,24.84 arc-90 71.1,25.3 71.1,26.36 arc90 70.36,27.1 70.32,27.1 arc90 69.59,26.36 69.59,25.3 arc-90 69.13,24.84 69.09,24.84 arc-90 68.63,25.3 68.63,26.36 arc90 67.89,27.1 67.85,27.1 arc90 67.11,26.36 67.11,25.3 arc-90 66.66,24.84 66.61,24.84 arc-90 66.16,25.3 66.16,26.36 arc90 65.42,27.1 65.38,27.1 arc90 64.64,26.36 64.64,25.3 arc-90 64.18,24.84 64.14,24.84 arc-90 63.68,25.3 63.68,26.36 arc90 62.95,27.1 62.9,27.1 arc90 62.16,26.36 62.16,25.3 arc-90 61.71,24.84 61.66,24.84 arc-90 61.21,25.3 61.21,26.36 arc90 60.47,27.1 60.43,27.1 arc90 59.69,26.36 59.69,25.3 arc-90 59.23,24.84 59.19,24.84 arc-90 58.73,25.3 58.73,26.36 arc90 58,27.1 57.95,27.1 arc90 57.22,26.36 57.22,25.3 arc-90 56.76,24.84 56.72,24.84 arc-90 56.26,25.3 56.26,26.36 arc90 55.52,27.1 55.48,27.1 arc90 54.74,26.36 54.74,25.3 arc-90 54.29,24.84 54.24,24.84 arc-90 53.79,25.3 53.79,26.36 arc90 53.05,27.1 53.01,27.1 arc90 52.27,26.36 52.27,25.3 arc-90 51.81,24.84 51.77,24.84 arc-90 51.31,25.3 51.31,26.36 arc90 50.58,27.1 50.53,27.1 arc90 49.8,26.36 49.8,25.3 arc-90 49.34,24.84 49.3,24.84 arc-90 48.84,25.3 48.84,26.36 arc90 48.1,27.1 48.06,27.1 arc90 47.33,26.36 47.33,25.3 arc-90 46.87,24.84 46.82,24.84 arc-90 46.37,25.3 46.37,26.36 arc90 45.63,27.1 45.59,27.1 arc90 44.85,26.36 44.85,25.3 arc-90 44.39,24.84 44.35,24.84 arc-90 43.89,25.3 43.89,41.9 arc90 43.16,42.64
ADC_PWR_EN  (2 unrouted)
ADC_REXT  (1 unrouted)
ADC_TDIODE+  (2 unrouted)
ADC_TDIODE-  (2 unrouted)
ADC_VBG  (1 unrouted)
ADC_VCMO  (1 unrouted)
ADC_VCMO_BUFFER  (4 unrouted)
ADC_VINI+  (1 unrouted)
ADC_VINI-  (1 unrouted)
AGND  (45 unrouted)
ANALOG_PWR_EN  (2 unrouted)
CLK500+  (1 unrouted)
CLK500-  (1 unrouted)
DGND  (148 unrouted)
  Top 0.152: U$1.P$97 26.25,61.62 26.03,61.84 26.03,62.09 arc-90 26.49,62.55 41.98,62.55 arc90 42.72,63.28 arc90 41.98,64.02 40.61,64.02 arc-90 40.15,64.48 arc-90 40.61,64.94 41.98,64.94 arc90 42.72,65.67 arc90 41.98,66.41 40.61,66.41 arc-90 40.15,66.87 arc-90 40.61,67.32 41.98,67.32 arc90 42.72,68.06 arc90 41.98,68.8 40.61,68.8 arc-90 40.15,69.25 arc-90 40.61,69.71 41.98,69.71 arc90 42.72,70.45 arc90 41.98,71.18 40.61,71.18 arc-90 40.15,71.64 arc-90 40.61,72.1 41.98,72.1 arc90 42.72,72.83 arc90 41.98,73.57 40.61,73.57 arc-90 40.15,74.03 arc-90 40.61,74.49 41.98,74.49 arc90 42.72,75.22 42.72,75.31 arc-90 43.18,75.76 77.82,75.76 arc-90 78.28,75.31 78.28,75.32 arc90 79.02,74.59 80.39,74.59 arc-90 80.85,74.13 arc-90 80.39,73.67 79.02,73.67 arc90 78.28,72.94 arc90 79.02,72.2 80.39,72.2 arc-90 80.85,71.74 arc-90 80.39,71.28 79.02,71.28 arc90 78.28,70.55 arc90 79.02,69.81 80.39,69.81 arc-90 80.85,69.35 arc-90 80.39,68.9 79.02,68.9 arc90 78.28,68.16 arc90 79.02,67.42 80.39,67.42 arc-90 80.85,66.97 arc-90 80.39,66.51 79.02,66.51 arc90 78.28,65.77 arc90 79.02,65.03 80.39,65.03 arc-90 80.85,64.58 arc-90 80.39,64.12 79.02,64.12 arc90 78.28,63.38 arc90 79.02,62.65 93.51,62.65 arc-90 93.97,62.19 | U$1.P$108 20.75,61.62 20.53,61.84 20.53,65.65 arc-90 20.99,66.1 28.65,66.1 arc90 29.39,66.84 arc90 28.65,67.58 28.15,67.58 arc-90 27.7,68.03 arc-90 28.15,68.49 28.65,68.49 arc90 29.39,69.23 arc90 28.65,69.97 28.15,69.97 arc-90 27.7,70.42 arc-90 28.15,70.88 28.65,70.88 arc90 29.39,71.62 arc90 28.65,72.35 28.15,72.35 arc-90 27.7,72.81 arc-90 28.15,73.27 28.65,73.27 arc90 29.39,74 arc90 28.65,74.74 28.15,74.74 arc-90 27.7,75.2 arc-90 28.15,75.65 28.65,75.65 arc90 29.39,76.39 arc90 28.65,77.13 28.15,77.13 arc-90 27.7,77.58 arc-90 28.15,78.04 28.65,78.04 arc90 29.39,78.78 29.39,78.86 arc-90 29.84,79.32 91.16,79.32 arc-90 91.61,78.86 91.61,78.88 arc90 92.35,78.14 92.85,78.14 arc-90 93.3,77.69 arc-90 92.85,77.23 92.35,77.23 arc90 91.61,76.49 arc90 92.35,75.75 92.85,75.75 arc-90 93.3,75.3 arc-90 92.85,74.84 92.35,74.84 arc90 91.61,74.1 arc90 92.35,73.37 92.85,73.37 arc-90 93.3,72.91 arc-90 92.85,72.45 92.35,72.45 arc90 91.61,71.72 arc90 92.35,70.98 92.85,70.98 arc-90 93.3,70.52 arc-90 92.85,70.06 92.35,70.06 arc90 91.61,69.33 arc90 92.35,68.59 92.85,68.59 arc-90 93.3,68.13 arc-90 92.85,67.68 92.35,67.68 arc90 91.61,66.94 arc90 92.35,66.2 98.51,66.2 arc-90 98.97,65.75 98.97,62.19
DI0+
  Top 0.152: U$1.P$103 24.75,62.98 arc-90 25.49,63.72 38.35,63.72 arc90 38.8,64.17 arc90 38.35,64.63 37.19,64.63 arc-90 36.45,65.37 arc-90 37.19,66.1 38.35,66.1 arc90 38.8,66.56 arc90 38.35,67.02 37.19,67.02 arc-90 36.45,67.75 arc-90 37.19,68.49 38.35,68.49 arc90 38.8,68.95 arc90 38.35,69.41 37.19,69.41 arc-90 36.45,70.14 arc-90 37.19,70.88 38.35,70.88 arc90 38.8,71.34 arc90 38.35,71.79 37.19,71.79 arc-90 36.45,72.53 arc-90 37.19,73.27 38.35,73.27 arc90 38.8,73.72 arc90 38.35,74.18 37.19,74.18 arc-90 36.45,74.92 arc-90 37.19,75.65 38.35,75.65 arc90 38.8,76.11 38.8,76.2 arc-90 39.54,76.93 81.46,76.93 arc-90 82.19,76.2 82.19,76.21 arc90 82.65,75.75 83.81,75.75 arc-90 84.55,75.02 arc-90 83.81,74.28 82.65,74.28 arc90 82.19,73.82 arc90 82.65,73.37 83.81,73.37 arc-90 84.55,72.63 arc-90 83.81,71.89 82.65,71.89 arc90 82.19,71.44 arc90 82.65,70.98 83.81,70.98 arc-90 84.55,70.24 arc-90 83.81,69.51 82.65,69.51 arc90 82.19,69.05 arc90 82.65,68.59 83.81,68.59 arc-90 84.55,67.86 arc-90 83.81,67.12 82.65,67.12 arc90 82.19,66.66 arc90 82.65,66.2 83.81,66.2 arc-90 84.55,65.47 arc-90 83.81,64.73 82.65,64.73 arc90 82.19,64.27 arc90 82.65,63.82 95.01,63.82 arc-90 95.75,63.08 U$2.P$101
DI1+  (1 unrouted)
  Top 0.152: U$2.P$104 94.25,62.19
DI1-  (1 unrouted)
  Top 0.152: U$2.P$105 93.75,61.72 93.97,61.94 93.97,62.19
DI2+
  Top 0.152: U$1.P$96 31.62,57.75 31.73,57.64 43.16,57.64 arc90 43.61,58.1 43.61,74.46 arc-90 44.35,75.2 44.39,75.2 arc-90 45.13,74.46 45.13,73.42 arc90 45.59,72.96 45.63,72.96 arc90 46.09,73.42 46.09,74.46 arc-90 46.82,75.2 46.87,75.2 arc-90 47.6,74.46 47.6,73.42 arc90 48.06,72.96 48.1,72.96 arc90 48.56,73.42 48.56,74.46 arc-90 49.3,75.2 49.34,75.2 arc-90 50.08,74.46 50.08,73.42 arc90 50.53,72.96 50.58,72.96 arc90 51.03,73.42 51.03,74.46 arc-90 51.77,75.2 51.81,75.2 arc-90 52.55,74.46 52.55,73.42 arc90 53.01,72.96 53.05,72.96 arc90 53.51,73.42 53.51,74.46 arc-90 54.24,75.2 54.29,75.2 arc-90 55.02,74.46 55.02,73.42 arc90 55.48,72.96 55.52,72.96 arc90 55.98,73.42 55.98,74.46 arc-90 56.72,75.2 56.76,75.2 arc-90 57.5,74.46 57.5,73.42 arc90 57.95,72.96 58,72.96 arc90 58.45,73.42 58.45,74.46 arc-90 59.19,75.2 59.23,75.2 arc-90 59.97,74.46 59.97,73.42 arc90 60.43,72.96 60.47,72.96 arc90 60.93,73.42 60.93,74.46 arc-90 61.66,75.2 61.71,75.2 arc-90 62.45,74.46 62.45,73.42 arc90 62.9,72.96 62.95,72.96 arc90 63.4,73.42 63.4,74.46 arc-90 64.14,75.2 64.18,75.2 arc-90 64.92,74.46 64.92,73.42 arc90 65.38,72.96 65.42,72.96 arc90 65.88,73.42 65.88,74.46 arc-90 66.61,75.2 66.66,75.2 arc-90 67.39,74.46 67.39,73.42 arc90 67.85,72.96 67.89,72.96 arc90 68.35,73.42 68.35,74.46 arc-90 69.09,75.2 69.13,75.2 arc-90 69.86,74.46 69.86,73.42 arc90 70.32,72.96 70.36,72.96 arc90 70.82,73.42 70.82,74.46 arc-90 71.56,75.2 71.6,75.2 arc-90 72.34,74.46 72.34,73.42 arc90 72.8,72.96 72.84,72.96 arc90 73.3,73.42 73.3,74.46 arc-90 74.03,75.2 74.08,75.2 arc-90 74.81,74.46 74.81,73.42 arc90 75.27,72.96 75.31,72.96 arc90 75.77,73.42 75.77,74.46 arc-90 76.51,75.2 76.55,75.2 arc-90 77.29,74.46 77.29,58.1 arc90 77.74,57.64 89.17,57.64 89.28,57.75 U$2.P$111
DI2-
  Top 0.152: U$1.P$95 31.62,57.25 31.73,57.36 43.16,57.36 arc90 43.89,58.1 43.89,74.46 arc-90 44.35,74.92 44.39,74.92 arc-90 44.85,74.46 44.85,73.42 arc90 45.59,72.68 45.63,72.68 arc90 46.37,73.42 46.37,74.46 arc-90 46.82,74.92 46.87,74.92 arc-90 47.33,74.46 47.33,73.42 arc90 48.06,72.68 48.1,72.68 arc90 48.84,73.42 48.84,74.46 arc-90 49.3,74.92 49.34,74.92 arc-90 49.8,74.46 49.8,73.42 arc90 50.53,72.68 50.58,72.68 arc90 51.31,73.42 51.31,74.46 arc-90 51.77,74.92 51.81,74.92 arc-90 52.27,74.46 52.27,73.42 arc90 53.01,72.68 53.05,72.68 arc90 53.79,73.42 53.79,74.46 arc-90 54.24,74.92 54.29,74.92 arc-90 54.74,74.46 54.74,73.42 arc90 55.48,72.68 55.52,72.68 arc90 56.26,73.42 56.26,74.46 arc-90 56.72,74.92 56.76,74.92 arc-90 57.22,74.46 57.22,73.42 arc90 57.95,72.68 58,72.68 arc90 58.73,73.42 58.73,74.46 arc-90 59.19,74.92 59.23,74.92 arc-90 59.69,74.46 59.69,73.42 arc90 60.43,72.68 60.47,72.68 arc90 61.21,73.42 61.21,74.46 arc-90 61.66,74.92 61.71,74.92 arc-90 62.16,74.46 62.16,73.42 arc90 62.9,72.68 62.95,72.68 arc90 63.68,73.42 63.68,74.46 arc-90 64.14,74.92 64.18,74.92 arc-90 64.64,74.46 64.64,73.42 arc90 65.38,72.68 65.42,72.68 arc90 66.16,73.42 66.16,74.46 arc-90 66.61,74.92 66.66,74.92 arc-90 67.11,74.46 67.11,73.42 arc90 67.85,72.68 67.89,72.68 arc90 68.63,73.42 68.63,74.46 arc-90 69.09,74.92 69.13,74.92 arc-90 69.59,74.46 69.59,73.42 arc90 70.32,72.68 70.36,72.68 arc90 71.1,73.42 71.1,74.46 arc-90 71.56,74.92 71.6,74.92 arc-90 72.06,74.46 72.06,73.42 arc90 72.8,72.68 72.84,72.68 arc90 73.58,73.42 73.58,74.46 arc-90 74.03,74.92 74.08,74.92 arc-90 74.53,74.46 74.53,73.42 arc90 75.27,72.68 75.31,72.68 arc90 76.05,73.42 76.05,74.46 arc-90 76.51,74.92 76.55,74.92 arc-90 77.01,74.46 77.01,58.1 arc90 77.74,57.36 89.17,57.36 89.28,57.25 U$2.P$112
DI3+
  Top 0.152: U$1.P$94 31.62,56.75 31.73,56.64 44.05,56.64 arc90 44.5,57.1 44.5,71.33 arc-90 45.24,72.07 45.31,72.07 arc-90 46.05,71.33 46.05,69.99 arc90 46.5,69.53 46.58,69.53 arc90 47.03,69.99 47.03,71.33 arc-90 47.77,72.07 47.84,72.07 arc-90 48.58,71.33 48.58,69.99 arc90 49.03,69.53 49.1,69.53 arc90 49.56,69.99 49.56,71.33 arc-90 50.3,72.07 50.37,72.07 arc-90 51.1,71.33 51.1,69.99 arc90 51.56,69.53 51.63,69.53 arc90 52.09,69.99 52.09,71.33 arc-90 52.83,72.07 52.9,72.07 arc-90 53.63,71.33 53.63,69.99 arc90 54.09,69.53 54.16,69.53 arc90 54.62,69.99 54.62,71.33 arc-90 55.36,72.07 55.43,72.07 arc-90 56.16,71.33 56.16,69.99 arc90 56.62,69.53 56.69,69.53 arc90 57.15,69.99 57.15,71.33 arc-90 57.88,72.07 57.96,72.07 arc-90 58.69,71.33 58.69,69.99 arc90 59.15,69.53 59.22,69.53 arc90 59.68,69.99 59.68,71.33 arc-90 60.41,72.07 60.48,72.07 arc-90 61.22,71.33 61.22,69.99 arc90 61.68,69.53 61.75,69.53 arc90 62.21,69.99 62.21,71.33 arc-90 62.94,72.07 63.02,72.07 arc-90 63.75,71.33 63.75,69.99 arc90 64.21,69.53 64.28,69.53 arc90 64.74,69.99 64.74,71.33 arc-90 65.47,72.07 65.54,72.07 arc-90 66.28,71.33 66.28,69.99 arc90 66.74,69.53 66.81,69.53 arc90 67.27,69.99 67.27,71.33 arc-90 68,72.07 68.07,72.07 arc-90 68.81,71.33 68.81,69.99 arc90 69.27,69.53 69.34,69.53 arc90 69.8,69.99 69.8,71.33 arc-90 70.53,72.07 70.6,72.07 arc-90 71.34,71.33 71.34,69.99 arc90 71.8,69.53 71.87,69.53 arc90 72.32,69.99 72.32,71.33 arc-90 73.06,72.07 73.13,72.07 arc-90 73.87,71.33 73.87,69.99 arc90 74.33,69.53 74.4,69.53 arc90 74.85,69.99 74.85,71.33 arc-90 75.59,72.07 75.66,72.07 arc-90 76.4,71.33 76.4,56.6 arc90 76.85,56.14 89.17,56.14 89.28,56.25 U$2.P$114
DI3-
  Top 0.152: U$1.P$93 31.62,56.25 31.73,56.36 44.05,56.36 arc90 44.78,57.1 44.78,71.33 arc-90 45.24,71.79 45.31,71.79 arc-90 45.77,71.33 45.77,69.99 arc90 46.5,69.25 46.58,69.25 arc90 47.31,69.99 47.31,71.33 arc-90 47.77,71.79 47.84,71.79 arc-90 48.3,71.33 48.3,69.99 arc90 49.03,69.25 49.1,69.25 arc90 49.84,69.99 49.84,71.33 arc-90 50.3,71.79 50.37,71.79 arc-90 50.83,71.33 50.83,69.99 arc90 51.56,69.25 51.63,69.25 arc90 52.37,69.99 52.37,71.33 arc-90 52.83,71.79 52.9,71.79 arc-90 53.35,71.33 53.35,69.99 arc90 54.09,69.25 54.16,69.25 arc90 54.9,69.99 54.9,71.33 arc-90 55.36,71.79 55.43,71.79 arc-90 55.88,71.33 55.88,69.99 arc90 56.62,69.25 56.69,69.25 arc90 57.43,69.99 57.43,71.33 arc-90 57.88,71.79 57.96,71.79 arc-90 58.41,71.33 58.41,69.99 arc90 59.15,69.25 59.22,69.25 arc90 59.96,69.99 59.96,71.33 arc-90 60.41,71.79 60.48,71.79 arc-90 60.94,71.33 60.94,69.99 arc90 61.68,69.25 61.75,69.25 arc90 62.49,69.99 62.49,71.33 arc-90 62.94,71.79 63.02,71.79 arc-90 63.47,71.33 63.47,69.99 arc90 64.21,69.25 64.28,69.25 arc90 65.02,69.99 65.02,71.33 arc-90 65.47,71.79 65.54,71.79 arc-90 66,71.33 66,69.99 arc90 66.74,69.25 66.81,69.25 arc90 67.55,69.99 67.55,71.33 arc-90 68,71.79 68.07,71.79 arc-90 68.53,71.33 68.53,69.99 arc90 69.27,69.25 69.34,69.25 arc90 70.07,69.99 70.07,71.33 arc-90 70.53,71.79 70.6,71.79 arc-90 71.06,71.33 71.06,69.99 arc90 71.8,69.25 71.87,69.25 arc90 72.6,69.99 72.6,71.33 arc-90 73.06,71.79 73.13,71.79 arc-90 73.59,71.33 73.59,69.99 arc90 74.33,69.25 74.4,69.25 arc90 75.13,69.99 75.13,71.33 arc-90 75.59,71.79 75.66,71.79 arc-90 76.12,71.33 76.12,56.6 arc90 76.85,55.86 89.17,55.86 89.28,55.75 U$2.P$115
DI4+
  Top 0.152: U$1.P$92 31.62,55.75 31.73,55.64 44.94,55.64 arc90 45.39,56.1 45.39,67.91 arc-90 46.13,68.64 46.23,68.64 arc-90 46.97,67.91 46.97,66.16 arc90 47.43,65.7 47.53,65.7 arc90 47.99,66.16 47.99,67.91 arc-90 48.72,68.64 48.83,68.64 arc-90 49.56,67.91 49.56,66.16 arc90 50.02,65.7 50.12,65.7 arc90 50.58,66.16 50.58,67.91 arc-90 51.32,68.64 51.42,68.64 arc-90 52.16,67.91 52.16,66.16 arc90 52.62,65.7 52.72,65.7 arc90 53.18,66.16 53.18,67.91 arc-90 53.91,68.64 54.02,68.64 arc-90 54.75,67.91 54.75,66.16 arc90 55.21,65.7 55.31,65.7 arc90 55.77,66.16 55.77,67.91 arc-90 56.51,68.64 56.61,68.64 arc-90 57.35,67.91 57.35,66.16 arc90 57.8,65.7 57.91,65.7 arc90 58.36,66.16 58.36,67.91 arc-90 59.1,68.64 59.2,68.64 arc-90 59.94,67.91 59.94,66.16 arc90 60.4,65.7 60.5,65.7 arc90 60.96,66.16 60.96,67.91 arc-90 61.7,68.64 61.8,68.64 arc-90 62.54,67.91 62.54,66.16 arc90 62.99,65.7 63.1,65.7 arc90 63.55,66.16 63.55,67.91 arc-90 64.29,68.64 64.39,68.64 arc-90 65.13,67.91 65.13,66.16 arc90 65.59,65.7 65.69,65.7 arc90 66.15,66.16 66.15,67.91 arc-90 66.88,68.64 66.99,68.64 arc-90 67.72,67.91 67.72,66.16 arc90 68.18,65.7 68.28,65.7 arc90 68.74,66.16 68.74,67.91 arc-90 69.48,68.64 69.58,68.64 arc-90 70.32,67.91 70.32,66.16 arc90 70.78,65.7 70.88,65.7 arc90 71.34,66.16 71.34,67.91 arc-90 72.07,68.64 72.18,68.64 arc-90 72.91,67.91 72.91,66.16 arc90 73.37,65.7 73.47,65.7 arc90 73.93,66.16 73.93,67.91 arc-90 74.67,68.64 74.77,68.64 arc-90 75.51,67.91 75.51,55.6 arc90 75.97,55.14 89.17,55.14 89.28,55.25 U$2.P$116
DI4-
  Top 0.152: U$1.P$91 31.62,55.25 31.73,55.36 44.94,55.36 arc90 45.67,56.1 45.67,67.91 arc-90 46.13,68.36 46.23,68.36 arc-90 46.69,67.91 46.69,66.16 arc90 47.43,65.42 47.53,65.42 arc90 48.27,66.16 48.27,67.91 arc-90 48.72,68.36 48.83,68.36 arc-90 49.28,67.91 49.28,66.16 arc90 50.02,65.42 50.12,65.42 arc90 50.86,66.16 50.86,67.91 arc-90 51.32,68.36 51.42,68.36 arc-90 51.88,67.91 51.88,66.16 arc90 52.62,65.42 52.72,65.42 arc90 53.45,66.16 53.45,67.91 arc-90 53.91,68.36 54.02,68.36 arc-90 54.47,67.91 54.47,66.16 arc90 55.21,65.42 55.31,65.42 arc90 56.05,66.16 56.05,67.91 arc-90 56.51,68.36 56.61,68.36 arc-90 57.07,67.91 57.07,66.16 arc90 57.8,65.42 57.91,65.42 arc90 58.64,66.16 58.64,67.91 arc-90 59.1,68.36 59.2,68.36 arc-90 59.66,67.91 59.66,66.16 arc90 60.4,65.42 60.5,65.42 arc90 61.24,66.16 61.24,67.91 arc-90 61.7,68.36 61.8,68.36 arc-90 62.26,67.91 62.26,66.16 arc90 62.99,65.42 63.1,65.42 arc90 63.83,66.16 63.83,67.91 arc-90 64.29,68.36 64.39,68.36 arc-90 64.85,67.91 64.85,66.16 arc90 65.59,65.42 65.69,65.42 arc90 66.43,66.16 66.43,67.91 arc-90 66.88,68.36 66.99,68.36 arc-90 67.44,67.91 67.44,66.16 arc90 68.18,65.42 68.28,65.42 arc90 69.02,66.16 69.02,67.91 arc-90 69.48,68.36 69.58,68.36 arc-90 70.04,67.91 70.04,66.16 arc90 70.78,65.42 70.88,65.42 arc90 71.62,66.16 71.62,67.91 arc-90 72.07,68.36 72.18,68.36 arc-90 72.63,67.91 72.63,66.16 arc90 73.37,65.42 73.47,65.42 arc90 74.21,66.16 74.21,67.91 arc-90 74.67,68.36 74.77,68.36 arc-90 75.23,67.91 75.23,55.6 arc90 75.97,54.86 89.17,54.86 89.28,54.75 U$2.P$117
DI5+
  Top 0.152: U$1.P$90 31.62,54.75 31.73,54.64 45.82,54.64 arc90 46.28,55.1 46.28,64.07 arc-90 47.02,64.81 47.04,64.81 arc-90 47.78,64.07 47.78,62.06 arc90 48.24,61.61 48.26,61.61 arc90 48.72,62.06 48.72,64.07 arc-90 49.46,64.81 49.48,64.81 arc-90 50.22,64.07 50.22,62.06 arc90 50.68,61.61 50.7,61.61 arc90 51.16,62.06 51.16,64.07 arc-90 51.9,64.81 51.92,64.81 arc-90 52.66,64.07 52.66,62.06 arc90 53.12,61.61 53.14,61.61 arc90 53.6,62.06 53.6,64.07 arc-90 54.34,64.81 54.36,64.81 arc-90 55.1,64.07 55.1,62.06 arc90 55.56,61.61 55.58,61.61 arc90 56.04,62.06 56.04,64.07 arc-90 56.78,64.81 56.8,64.81 arc-90 57.54,64.07 57.54,62.06 arc90 58,61.61 58.02,61.61 arc90 58.48,62.06 58.48,64.07 arc-90 59.22,64.81 59.24,64.81 arc-90 59.98,64.07 59.98,62.06 arc90 60.44,61.61 60.46,61.61 arc90 60.92,62.06 60.92,64.07 arc-90 61.66,64.81 61.68,64.81 arc-90 62.42,64.07 62.42,62.06 arc90 62.88,61.61 62.9,61.61 arc90 63.36,62.06 63.36,64.07 arc-90 64.1,64.81 64.12,64.81 arc-90 64.86,64.07 64.86,62.06 arc90 65.32,61.61 65.34,61.61 arc90 65.8,62.06 65.8,64.07 arc-90 66.54,64.81 66.56,64.81 arc-90 67.3,64.07 67.3,62.06 arc90 67.76,61.61 67.78,61.61 arc90 68.24,62.06 68.24,64.07 arc-90 68.98,64.81 69,64.81 arc-90 69.74,64.07 69.74,62.06 arc90 70.2,61.61 70.22,61.61 arc90 70.68,62.06 70.68,64.07 arc-90 71.42,64.81 71.44,64.81 arc-90 72.18,64.07 72.18,62.06 arc90 72.64,61.61 72.66,61.61 arc90 73.12,62.06 73.12,64.07 arc-90 73.86,64.81 73.88,64.81 arc-90 74.62,64.07 74.62,54.6 arc90 75.08,54.14 89.17,54.14 89.28,54.25 U$2.P$118
DI5-
  Top 0.152: U$1.P$89 31.62,54.25 31.73,54.36 45.82,54.36 arc90 46.56,55.1 46.56,64.07 arc-90 47.02,64.53 47.04,64.53 arc-90 47.5,64.07 47.5,62.06 arc90 48.24,61.33 48.26,61.33 arc90 49,62.06 49,64.07 arc-90 49.46,64.53 49.48,64.53 arc-90 49.94,64.07 49.94,62.06 arc90 50.68,61.33 50.7,61.33 arc90 51.44,62.06 51.44,64.07 arc-90 51.9,64.53 51.92,64.53 arc-90 52.38,64.07 52.38,62.06 arc90 53.12,61.33 53.14,61.33 arc90 53.88,62.06 53.88,64.07 arc-90 54.34,64.53 54.36,64.53 arc-90 54.82,64.07 54.82,62.06 arc90 55.56,61.33 55.58,61.33 arc90 56.32,62.06 56.32,64.07 arc-90 56.78,64.53 56.8,64.53 arc-90 57.26,64.07 57.26,62.06 arc90 58,61.33 58.02,61.33 arc90 58.76,62.06 58.76,64.07 arc-90 59.22,64.53 59.24,64.53 arc-90 59.7,64.07 59.7,62.06 arc90 60.44,61.33 60.46,61.33 arc90 61.2,62.06 61.2,64.07 arc-90 61.66,64.53 61.68,64.53 arc-90 62.14,64.07 62.14,62.06 arc90 62.88,61.33 62.9,61.33 arc90 63.64,62.06 63.64,64.07 arc-90 64.1,64.53 64.12,64.53 arc-90 64.58,64.07 64.58,62.06 arc90 65.32,61.33 65.34,61.33 arc90 66.08,62.06 66.08,64.07 arc-90 66.54,64.53 66.56,64.53 arc-90 67.02,64.07 67.02,62.06 arc90 67.76,61.33 67.78,61.33 arc90 68.52,62.06 68.52,64.07 arc-90 68.98,64.53 69,64.53 arc-90 69.46,64.07 69.46,62.06 arc90 70.2,61.33 70.22,61.33 arc90 70.96,62.06 70.96,64.07 arc-90 71.42,64.53 71.44,64.53 arc-90 71.9,64.07 71.9,62.06 arc90 72.64,61.33 72.66,61.33 arc90 73.4,62.06 73.4,64.07 arc-90 73.86,64.53 73.88,64.53 arc-90 74.34,64.07 74.34,54.6 arc90 75.08,53.86 89.17,53.86 89.28,53.75 U$2.P$119
DI6+